# Altium schematic sheet ESD-Monitor.SchDoc
size A4
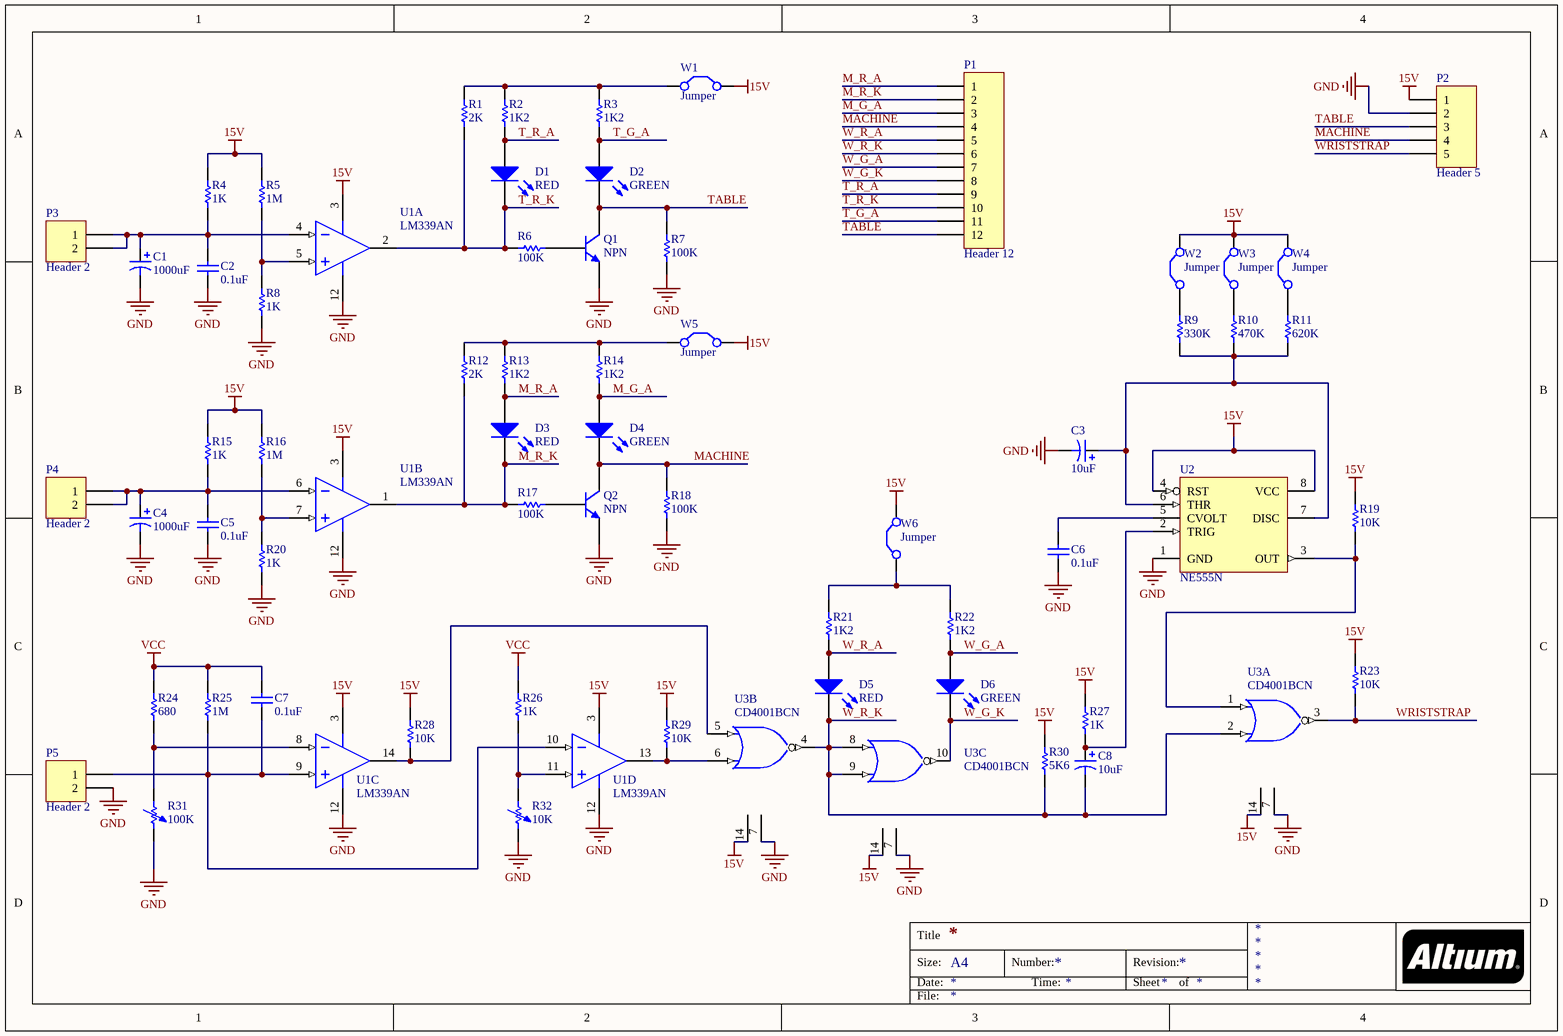
[diagram p0: ESD-Monitor.SchDoc]

## Parts
C1  1000uF  [E3,5-10]
C2  0.1uF  [C025-024X044]
C3  10uF  [E2,5-5]
C4  1000uF  [E3,5-10]
C5  0.1uF  [C025-024X044]
C6  0.1uF  [C025-024X044]
C7  0.1uF  [C025-024X044]
C8  10uF  [E2,5-5]
D1  RED
D2  GREEN
D3  RED
D4  GREEN
D5  RED
D6  GREEN
P1  Header 12  [6410-12]
P2  Header 5  [6410-05]
P3  Header 2  [7395-02]
P4  Header 2  [7395-02]
P5  Header 2  [7395-02]
Q1  NPN  [TO92]
Q2  NPN  [TO92]
R1  2K  [0207/10]
R2  1K2  [0207/10]
R3  1K2  [0207/10]
R4  1K  [0207/10]
R5  1M  [0207/10]
R6  100K  [0207/10]
R7  100K  [0207/10]
R8  1K  [0207/10]
R9  330K  [0207/10]
R10  470K  [0207/10]
R11  620K  [0207/10]
R12  2K  [0207/10]
R13  1K2  [0207/10]
R14  1K2  [0207/10]
R15  1K  [0207/10]
R16  1M  [0207/10]
R17  100K  [0207/10]
R18  100K  [0207/10]
R19  10K  [0207/10]
R20  1K  [0207/10]
R21  1K2  [0207/10]
R22  1K2  [0207/10]
R23  10K  [0207/10]
R24  680  [0207/10]
R25  1M  [0207/10]
R26  1K  [0207/10]
R27  1K  [0207/10]
R28  10K  [0207/10]
R29  10K  [0207/10]
R30  5K6  [0207/10]
R31  100K  [CA6V]
R32  10K  [CA6V]
U1  LM339AN  [646-06]  (parts A,B,C,D of 4)
U2  NE555N  [DIP8]
U3  CD4001BCN  [N14A]  (parts A,B,C of 4)
W1  Jumper  [HDR1X2]
W2  Jumper  [HDR1X2]
W3  Jumper  [HDR1X2]
W4  Jumper  [HDR1X2]
W5  Jumper  [HDR1X2]
W6  Jumper  [HDR1X2]

## Nets
15V: P2.1 R4.2 R5.2 R15.2 R16.2 R19.2 R23.2 R27.2 R28.2 R29.2 R30.2 U1.3(V+) U2.4(RST) U2.8(VCC) U3.14(VDD) W1.2(C2) W2.2(C2) W3.2(C2) W4.2(C2) W5.2(C2) W6.2(C2)  [also labelled VDD]
GND: C1.2 C2.1 C3.2 C4.2 C5.1 C6.1 P2.2 P5.2 Q1.3(E) Q2.3(E) R7.1 R8.1 R18.1 R20.1 R31.2 R32.2 U1.12(GND) U2.1(GND) U3.7(GND)
VCC: C7.2 R24.2 R25.2 R26.2
M_G_A: D4.1(A) P1.3 R14.1
M_R_A: D3.1(A) P1.1 R13.1
M_R_K: D3.2(K) P1.2 R12.1 R17.2 U1.1(OUT)
MACHINE: D4.2(K) P1.4 P2.4 Q2.1(C) R18.2
T_G_A: D2.1(A) P1.11 R3.1
T_R_A: D1.1(A) P1.9 R2.1
T_R_K: D1.2(K) P1.10 R1.1 R6.2 U1.2(OUT)
TABLE: D2.2(K) P1.12 P2.3 Q1.1(C) R7.2
W_G_A: D6.1(A) P1.7 R22.1
W_G_K: D6.2(K) P1.8 U3.10(J)
W_R_A: D5.1(A) P1.5 R21.1
W_R_K: C8.2 D5.2(K) P1.6 R30.1 U3.2(B) U3.4(J) U3.8(A) U3.9(B)
WRISTSTRAP: P2.5 R23.1 U3.3(J)
NetC1_1: C1.1 C2.2 P3.1 P3.2 R4.1 U1.4(IN-)
NetC3_1: C3.1 R9.1 R10.1 R11.1 U2.6(THR) U2.7(DISC)
NetC4_1: C4.1 C5.2 P4.1 P4.2 R15.1 U1.6(IN-)
NetC6_2: C6.2 U2.5(CVOLT)
NetC7_1: C7.1 P5.1 R25.1 U1.9(IN+) U1.10(IN-)
NetC8_1: C8.1 R27.1 U2.2(TRIG)
NetQ1_2: Q1.2(B) R6.1
NetQ2_2: Q2.2(B) R17.1
NetR1_2: R1.2 R2.2 R3.2 W1.1(C1)
NetR5_1: R5.1 R8.2 U1.5(IN+)
NetR9_2: R9.2 W2.1(C1)
NetR10_2: R10.2 W3.1(C1)
NetR11_2: R11.2 W4.1(C1)
NetR12_2: R12.2 R13.2 R14.2 W5.1(C1)
NetR16_1: R16.1 R20.2 U1.7(IN+)
NetR19_1: R19.1 U2.3(OUT) U3.1(A)
NetR21_2: R21.2 R22.2 W6.1(C1)
NetR24_1: R24.1 R31.1 U1.8(IN-)
NetR26_1: R26.1 R32.1 U1.11(IN+)
NetR28_1: R28.1 U1.14(OUT) U3.5(A)
NetR29_1: R29.1 U1.13(OUT) U3.6(B)

## Notes on the sheet
- Title
- Size:
- Date:
- A4
- Number:
- Time:
- Revision:
- Sheet
- of
- File:

## Library data of the parts
C1 C3 C4 C8 = Cap Pol1: Polarized Capacitor (Radial); Published: 8-Jun-2000; LatestRevisionDate: 17-Jul-2002; LatestRevisionNote: Re-released for DXP Platform.; PackageReference: RB7.6-15; Publisher: Altium Limited; PackageDescription: Polarized Capacitor (Radial); 2 Leads
  C1 C4: Value: 1000uF
  C3 C8: Value: 10uF
C2 C5-C7 = Cap: Capacitor; Published: 8-Jun-2000; LatestRevisionDate: 17-Jul-2002; LatestRevisionNote: Re-released for DXP Platform.; PackageReference: RAD-0.3; Publisher: Altium Limited; PackageDescription: Radial Cap, Thru-Hole; 2 Leads; 0.3 in Pin Spacing; Value: 0.1uF
D1-D6 = LED0: Typical INFRARED GaAs LED; Published: 8-Jun-2000; LatestRevisionDate: 08-Jul-2005; LatestRevisionNote: Mech Layer 1 removed.; PackageReference: LED-0; Publisher: Altium Limited; PackageDescription: LED; 2 Leads
P1 = Header 12: Header, 12-Pin; LatestRevisionDate: 17-Jul-2002; LatestRevisionNote: Re-released for DXP Platform.; Publisher: Altium Limited
P2 = Header 5: Header, 5-Pin; LatestRevisionDate: 17-Jul-2002; LatestRevisionNote: Re-released for DXP Platform.; Publisher: Altium Limited
P3-P5 = Header 2: Header, 2-Pin; LatestRevisionDate: 17-Jul-2002; LatestRevisionNote: Re-released for DXP Platform.; Publisher: Altium Limited
Q1 Q2 = NPN: NPN Bipolar Transistor; Published: 8-Jun-2000; LatestRevisionDate: 17-Jul-2002; LatestRevisionNote: Re-released for DXP Platform.; PackageReference: TO-226-AA; Publisher: Altium Limited; PackageDescription: TO, Flat Index; 3 In-Line, Axial Leads; Body Dia. 4.8mm; Leads 0.55 x 0.51 mm (max); Code_JEDEC: TO-226-AA
R1-R30 = Res1: Resistor; Published: 8-Jun-2000; LatestRevisionDate: 17-Jul-2002; LatestRevisionNote: Re-released for DXP Platform.; PackageReference: AXIAL-0.3; Publisher: Altium Limited; PackageDescription: Axial Device, Thru-Hole; 2 Leads; 0.3 in Pin Spacing
  R1 R12: Value: 2K
  R2 R3 R13 R14 R21 R22: Value: 1K2
  R4 R8 R15 R20 R26 R27: Value: 1K
  R5 R16 R25: Value: 1M
  R6 R7 R17 R18: Value: 100K
  R9: Value: 330K
  R10: Value: 470K
  R11: Value: 620K
  R19 R23 R28 R29: Value: 10K
  R24: Value: 680
  R30: Value: 5K6
R31 R32 = Res Adj1: Variable Resistor; Set Position: 0.5; Published: 8-Jun-2000; LatestRevisionDate: 17-Jul-2002; LatestRevisionNote: Re-released for DXP Platform.; PackageReference: AXIAL-0.7; Publisher: Altium Limited; PackageDescription: Axial Device, Thru-Hole; 2 Leads; 0.7 in Pin Spacing
  R31: Value: 100K
  R32: Value: 10K
U1 = LM339AN: Quad Single-Supply Comparator; Published: 17-Jul-2002; LatestRevisionDate: 06-Jun-2005; LatestRevisionNote: Stylized 3D Model Added.; DatasheetVersion: 1988; PackageVersion: 1997; PackageReference: 646-06; Publisher: Altium Limited; PackageDescription: DIP; 14 Leads; Row Spacing 7.62 mm; Pitch 2.54 mm; ComponentLink1Description: Manufacturer Link; ComponentLink1URL: http://www.onsemi.com/site/products/taxonomy/0,4438,133,00.html
U2 = NE555N: General-Purpose Single Bipolar Timer; Published: 24-Aug-2001; LatestRevisionDate: 06-Jun-2005; LatestRevisionNote: Stylized 3D Model Added.; DatasheetVersion: Jul-1998; PackageReference: DIP8; Publisher: Altium Limited; PackageDescription: DIP; 8 Leads; Row Spacing 7.62 mm; Pitch 2.54 mm; Code_JEDEC: MO-001-AN; ComponentLink1Description: Manufacturer Link; ComponentLink1URL: http://www.st.com/; ComponentLink2Description: Datasheet; ComponentLink2URL: http://www.st.com/stonline/products/literature/ds/2182/ne555.pdf
U3 = CD4001BCN: Quad 2-Input NOR Buffered B series Gate, 14-Pin PDIP; IC_Technology: C; Published: 17-Jul-2002; LatestRevisionDate: 29-May-2009; LatestRevisionNote: Component Body Added.; DatasheetVersion: Jan-1999; PackageVersion: 2000; PackageReference: N14A; Publisher: Altium Limited; PackageDescription: DIP, 14-Pin, Row Spacing 7.62 mm, Pitch 2.54 mm; ComponentLink1Description: Manufacturer Link; ComponentLink1URL: http://www.fairchildsemi.com/; ComponentLink2Description: Datasheet; ComponentLink2URL: http://www.fairchildsemi.com/ds/CD%2FCD4001BC.pdf
W1-W6 = Jumper: Jumper Wire; Published: 24-Mar-1999; LatestRevisionDate: 17-Jul-2002; LatestRevisionNote: Re-released for DXP Platform.; PackageReference: RAD-0.2; Publisher: Altium Limited; PackageDescription: Radial Cap, Thru-Hole; 2 Leads; 0.2 in Pin Spacing